# EasyEDA schematic SCH_老年人姿态识别系统0622_2026-06-30.json
TITLE: Sheet_1; REV: 1.0; Sheet: 1/1; Company: Your Company
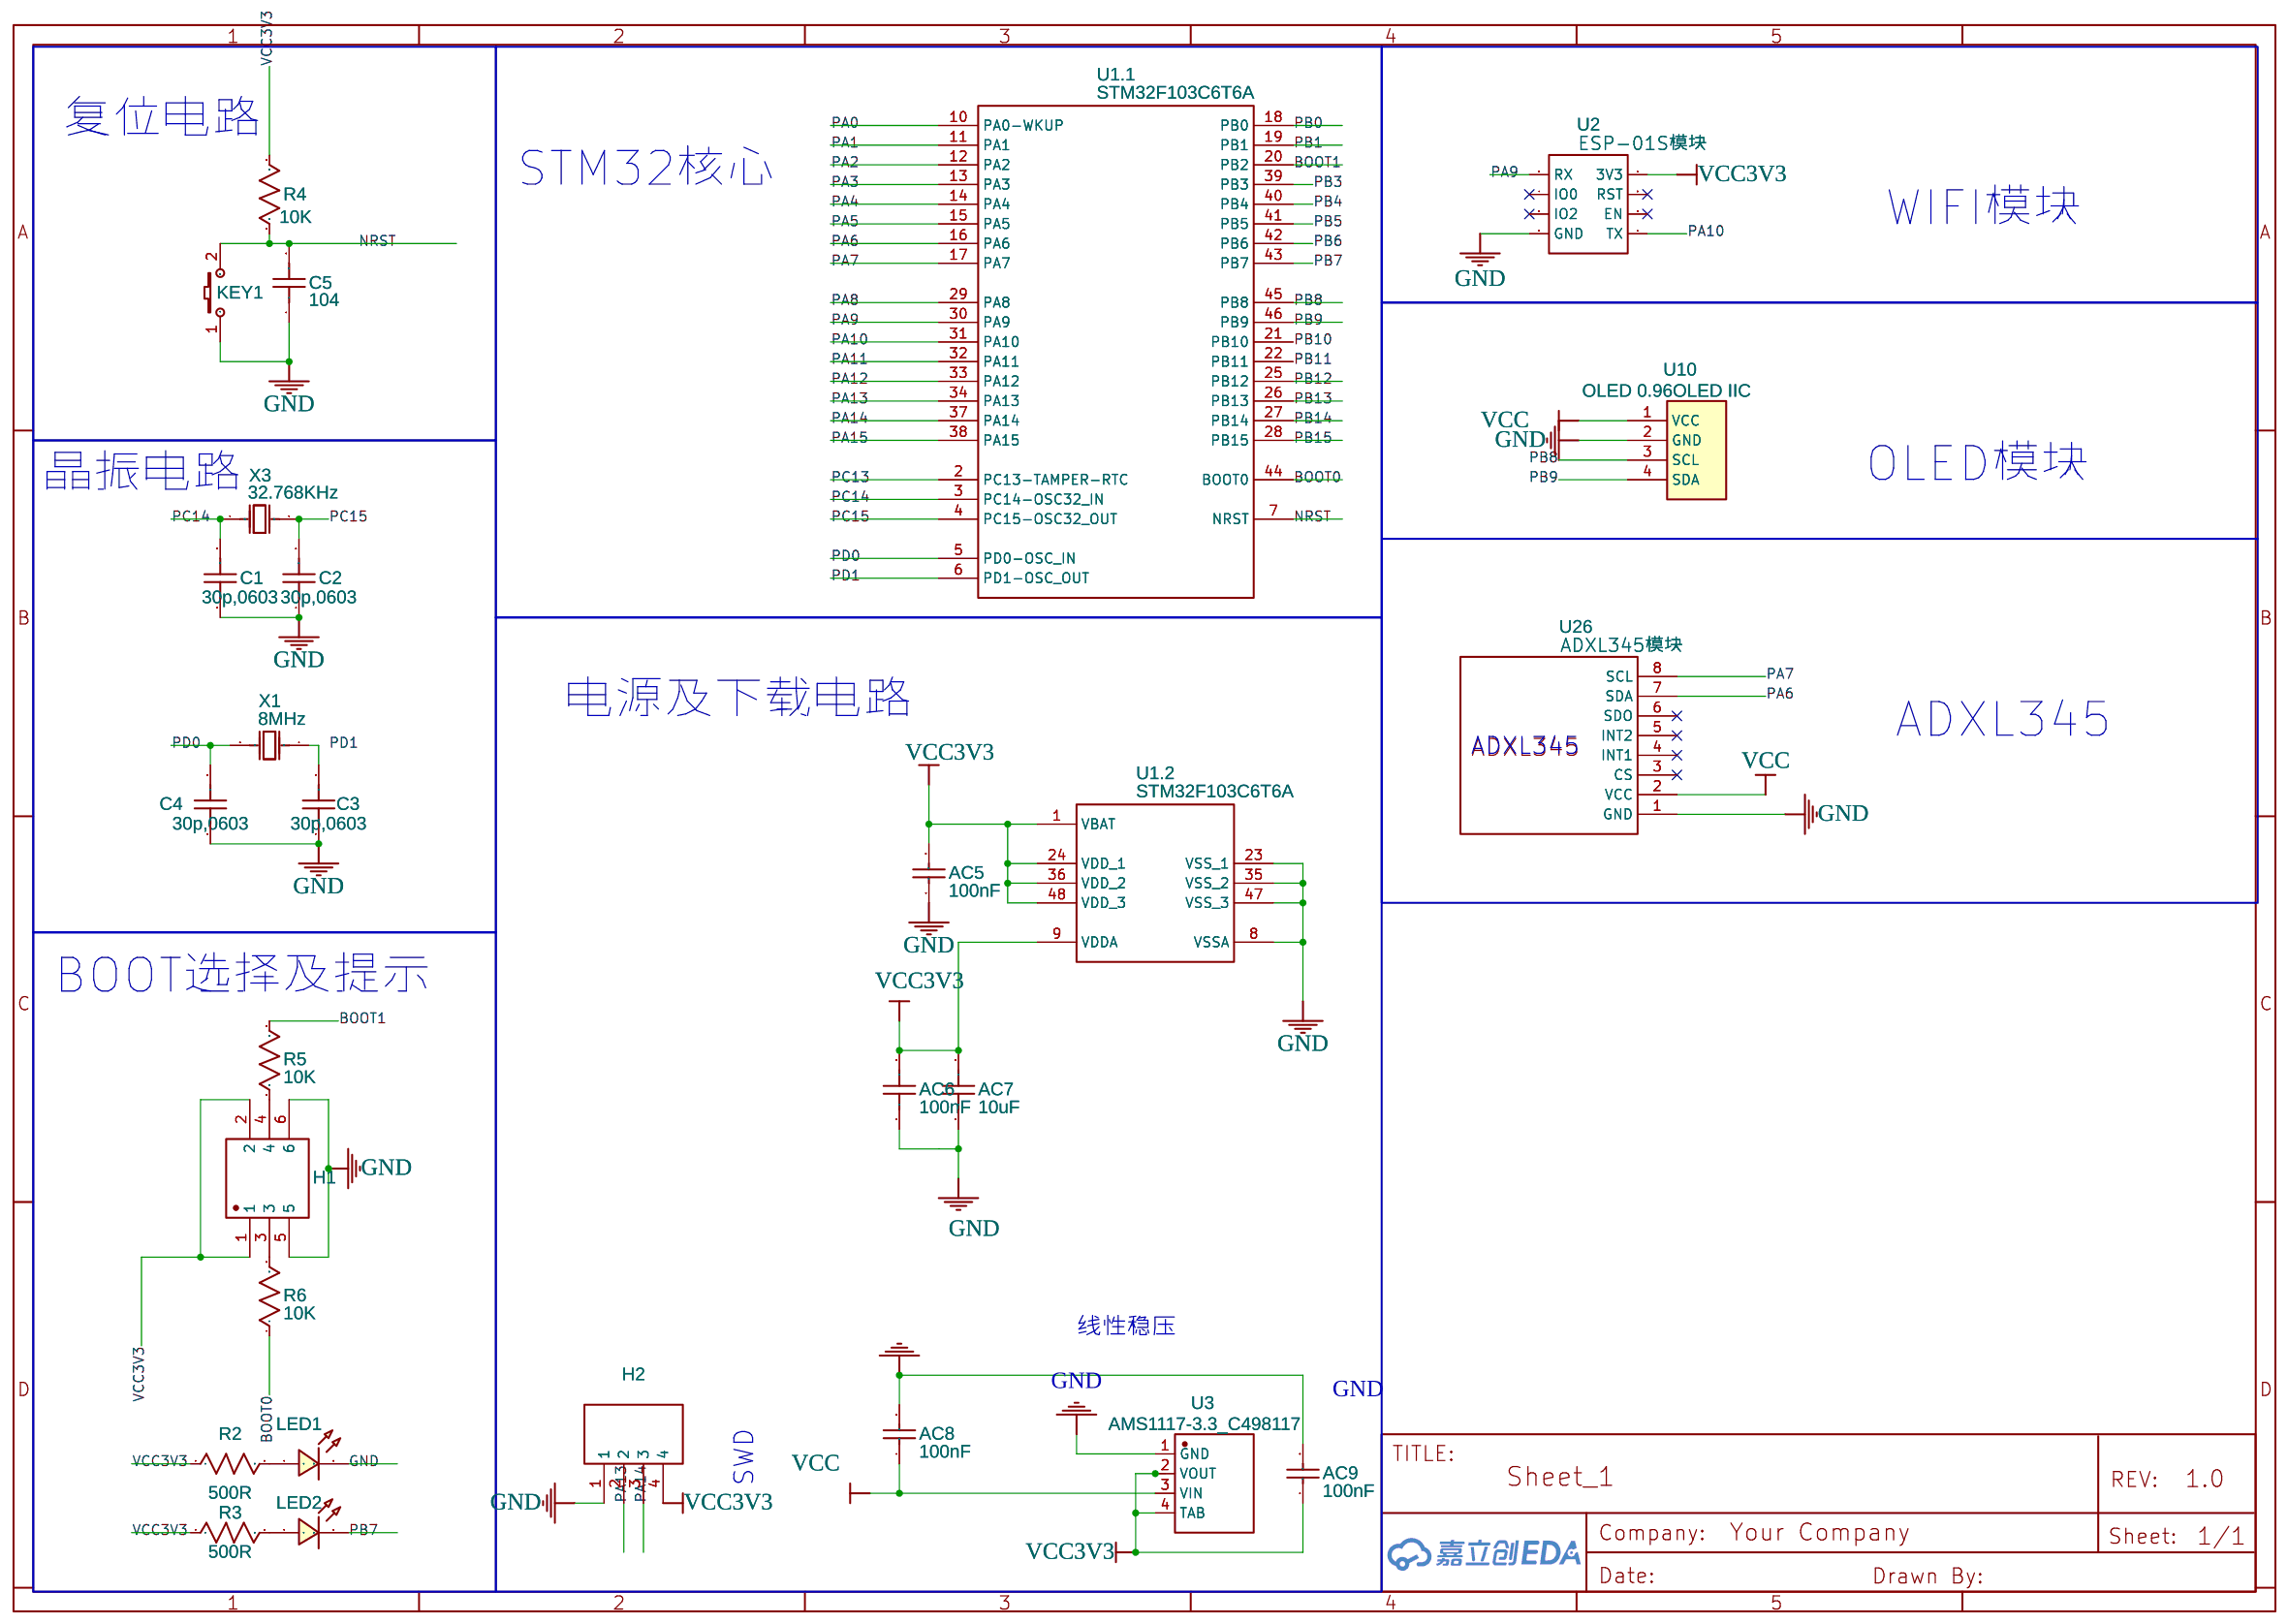
[diagram p0: schematic sheet]

## Parts
AC5  100nF  [C0603]
AC6  100nF  [0603]
AC7  10uF  [0805]
AC8  100nF  [C0805]
AC9  100nF  [C0805]
C1  30p,0603  [C0603]
C2  30p,0603  [C0603]
C3  30p,0603  [C0603]
C4  30p,0603  [C0603]
C5  104  [C0603]
H1  210S-2*3P L=11.6MMGold-plated black  [HDR-TH_6P-P2.54-V-R2-C3-S2.54]
H2  220S-1*4P H=8.5MM Ytype Gold-plated  [DIP-1X4P2.54]
KEY1  K2-3.6×6.1_SMD  [KEY-3.0*4.0]
LED1  LED-0603_R  [LED0603_RED]
LED2  LED-0603_R  [LED0603_RED]
R2  500R  [R0603]
R3  500R  [R0603]
R4  10K  [R0603]
R5  10K  [R0603]
R6  10K  [R0603]
U1  STM32F103C6T6A  [LQFP-48_L7.0-W7.0-P0.50-LS9.0-BL]  (sections 1,2)
U2  ESP-01S模块  [ESP01S]
U3  AMS1117-3.3_C498117  [PG-SOT223-4_L6.5-W3.5-P2.30-LS7.0-BR]
U10  OLED 0.96OLED IIC  [OLED10.96OLED]
U26  ADXL345模块  [ADXL345模块]
X1  8MHz  [HC-49S_L11.4-W4.8]
X3  32.768KHz  [CRYSTAL_SMD_SEIKOEPSON_MC156-4PIN_7.1X2.5MM]

## Library data of the parts
AC5 AC8 AC9 = 100nF: Supplier: LCSC; Manufacturer: LCSC; Manufacturer Part: 0.1UF(104) +-20% 63v; Supplier Part: C19355
AC6 = Cap_0603_US
AC7 = Cap_0805_US
C1 C4 C5 = C_0603_US: Contributor: LCEDA_Lib
C2 C3 = C_0603_US: Contributor: LCEDA_Lib; Package Display: No
H1 = 210S-2*3P L=11.6MMGold-plated black: Supplier: LCSC; Manufacturer: Ckmtw; Contributor: LCSC; Supplier Part: C124384
H2 = 220S-1*4P H=8.5MM Ytype Gold-plated: Supplier: LCSC; Manufacturer: Ckmtw; Contributor: LCSC; Supplier Part: C124413
KEY1 = K2-3.6×6.1_SMD: Supplier Part: C118141; Supplier: LCSC; Manufacturer Part: K2-1107ST-A4SW-06; Contributor: LCEDA_Lib; 制造商: 韩国韩荣
LED1 LED2 = LED-0603_R: Manufacturer: EVERLIGHT(台湾亿光); Manufacturer Part: 19-217/R6C-AL1M2VY/3T; Supplier Part: C72044; Supplier: LCSC; Contributor: LCEDA_01
R2-R6 = R_0603_US: Contributor: LCEDA_Lib
U1 = STM32F103C6T6A: tags: STM32; Supplier Part: C8303; Supplier: LCSC; Manufacturer: ST; subpart_no: 1; image: http://image.lceda.cn/szlcsc/C8303.jpg
U2 = ESP-01S模块: Contributor: fqsun
U3 = AMS1117-3.3_C498117: Supplier: LCSC; Supplier Part: C498117; Manufacturer: HGC(Huaguan Semicon); Manufacturer Part: AMS1117-3.3; Contributor: cufes2
U10 = OLED 0.96OLED IIC: Contributor: cloudy_fall
U26 = ADXL345模块: Contributor: qdufq
X1 = X49SM13MSD2SC: Supplier: LCSC; Manufacturer: YXC; Supplier Part: C70699
X3 = X49SD304MSD2SC: Supplier: LCSC; Manufacturer: YXC; Supplier Part: C52061

## Nets
GND: AC5.1 AC6.1 AC7.1 AC8.2 AC9.2 C1.1 C2.1 C3.1 C4.1 C5.1 H1.5 H1.6 H2.1 KEY1.1 LED1.2 U1.8(VSSA) U1.23(VSS_1) U1.35(VSS_2) U1.47(VSS_3) U2.5(GND) U3.1(GND) U10.2(GND) U26.1(GND)
VCC: AC8.1 U3.3(VIN) U10.1(VCC) U26.2(VCC)
VCC3V3: AC5.2 AC6.2 AC7.2 AC9.1 H1.1 H1.2 H2.4 R2.1 R3.1 R4.2 U1.1(VBAT) U1.9(VDDA) U1.24(VDD_1) U1.36(VDD_2) U1.48(VDD_3) U2.1(3V3) U3.2(VOUT) U3.4(TAB)
BOOT0: R6.1 U1.44(BOOT0)
BOOT1: R5.2 U1.20(PB2)
NRST: C5.2 KEY1.2 R4.1 U1.7(NRST)
PA0: U1.10(PA0-WKUP)
PA1: U1.11(PA1)
PA2: U1.12(PA2)
PA3: U1.13(PA3)
PA4: U1.14(PA4)
PA5: U1.15(PA5)
PA6: U1.16(PA6) U26.7(SDA)
PA7: U1.17(PA7) U26.8(SCL)
PA8: U1.29(PA8)
PA9: U1.30(PA9) U2.8(RX)
PA10: U1.31(PA10) U2.4(TX)
PA11: U1.32(PA11)
PA12: U1.33(PA12)
PA13: H2.2 U1.34(PA13)
PA14: H2.3 U1.37(PA14)
PA15: U1.38(PA15)
PB0: U1.18(PB0)
PB1: U1.19(PB1)
PB3: U1.39(PB3)
PB4: U1.40(PB4)
PB5: U1.41(PB5)
PB6: U1.42(PB6)
PB7: LED2.2 U1.43(PB7)
PB8: U1.45(PB8) U10.3(SCL)
PB9: U1.46(PB9) U10.4(SDA)
PB10: U1.21(PB10)
PB11: U1.22(PB11)
PB12: U1.25(PB12)
PB13: U1.26(PB13)
PB14: U1.27(PB14)
PB15: U1.28(PB15)
PC13: U1.2(PC13-TAMPER-RTC)
PC14: C1.2 U1.3(PC14-OSC32_IN) X3.1(OSC1)
PC15: C2.2 U1.4(PC15-OSC32_OUT) X3.2(OSC2)
PD0: C4.2 U1.5(PD0-OSC_IN) X1.2(OSC2)
PD1: U1.6(PD1-OSC_OUT)
Net-(C3-2): C3.2 X1.1(OSC1)
Net-(H1-3): H1.3 R6.2
Net-(H1-4): H1.4 R5.1
Net-(LED1-1): LED1.1 R2.2
Net-(LED2-1): LED2.1 R3.2

Not connected (* = marked no-connect by the designer): U2 2(RST)* 3(EN)* 6(IO2)* 7(IO0)*; U26 3(CS)* 4(INT1)* 5(INT2)* 6(SDO)*

## Notes on the sheet
- 复位电路
- STM32核心
- WIFI模块
- 晶振电路
- OLED模块
- 电源及下载电路
- ADXL345
- ADXL345
- BOOT选择及提示
- 线性稳压
- SWD
